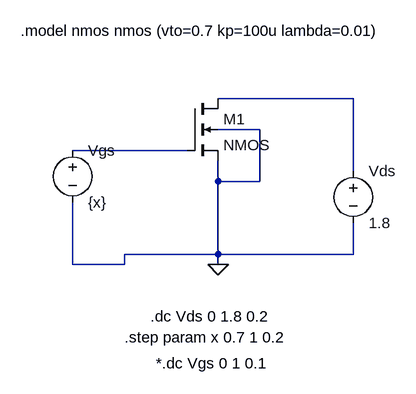
[diagram p0: schematic Exp1 (1).asc]
Exp1 (1).asc, the LTspice schematic file:
Version 4
SHEET 1 880 680
WIRE 432 48 224 48
WIRE 288 96 224 96
WIRE 176 128 0 128
WIRE 432 160 432 48
WIRE 224 176 224 144
WIRE 288 176 288 96
WIRE 288 176 224 176
WIRE 224 288 224 176
WIRE 224 288 80 288
WIRE 432 288 432 240
WIRE 432 288 224 288
WIRE 0 304 0 208
WIRE 80 304 80 288
WIRE 80 304 0 304
WIRE 224 304 224 288
FLAG 224 304 0
SYMBOL voltage 0 112 R0
WINDOW 123 0 0 Left 0
WINDOW 39 0 0 Left 0
SYMATTR InstName Vgs
SYMATTR Value {x}
SYMBOL voltage 432 144 R0
WINDOW 123 0 0 Left 0
WINDOW 39 0 0 Left 0
SYMATTR InstName Vds
SYMATTR Value 1.8
SYMBOL nmos4 176 48 R0
SYMATTR InstName M1
SYMATTR Value2 l=1u w=20u
TEXT -80 -56 Left 2 !.model nmos nmos (vto=0.7 kp=100u lambda=0.01)
TEXT 120 384 Left 2 !.dc Vds 0 1.8 0.2
TEXT 80 416 Left 2 !.step param x 0.7 1 0.2
TEXT 128 456 Left 2 !*.dc Vgs 0 1 0.1

The netlist it stands for:
* Exp1 (1).asc
Vgs N002 0 {x}
Vds N001 0 1.8
M1 N001 N002 0 0 NMOS l=1u w=20u
.model NMOS NMOS
.model PMOS PMOS
.lib standard.mos
.model nmos nmos (vto=0.7 kp=100u lambda=0.01)
.dc Vds 0 1.8 0.2
.step param x 0.7 1 0.2
*.dc Vgs 0 1 0.1
.backanno
.end